# EAGLE design SparkFun_Polar-HeartRate (EAGLE 7.2.0)
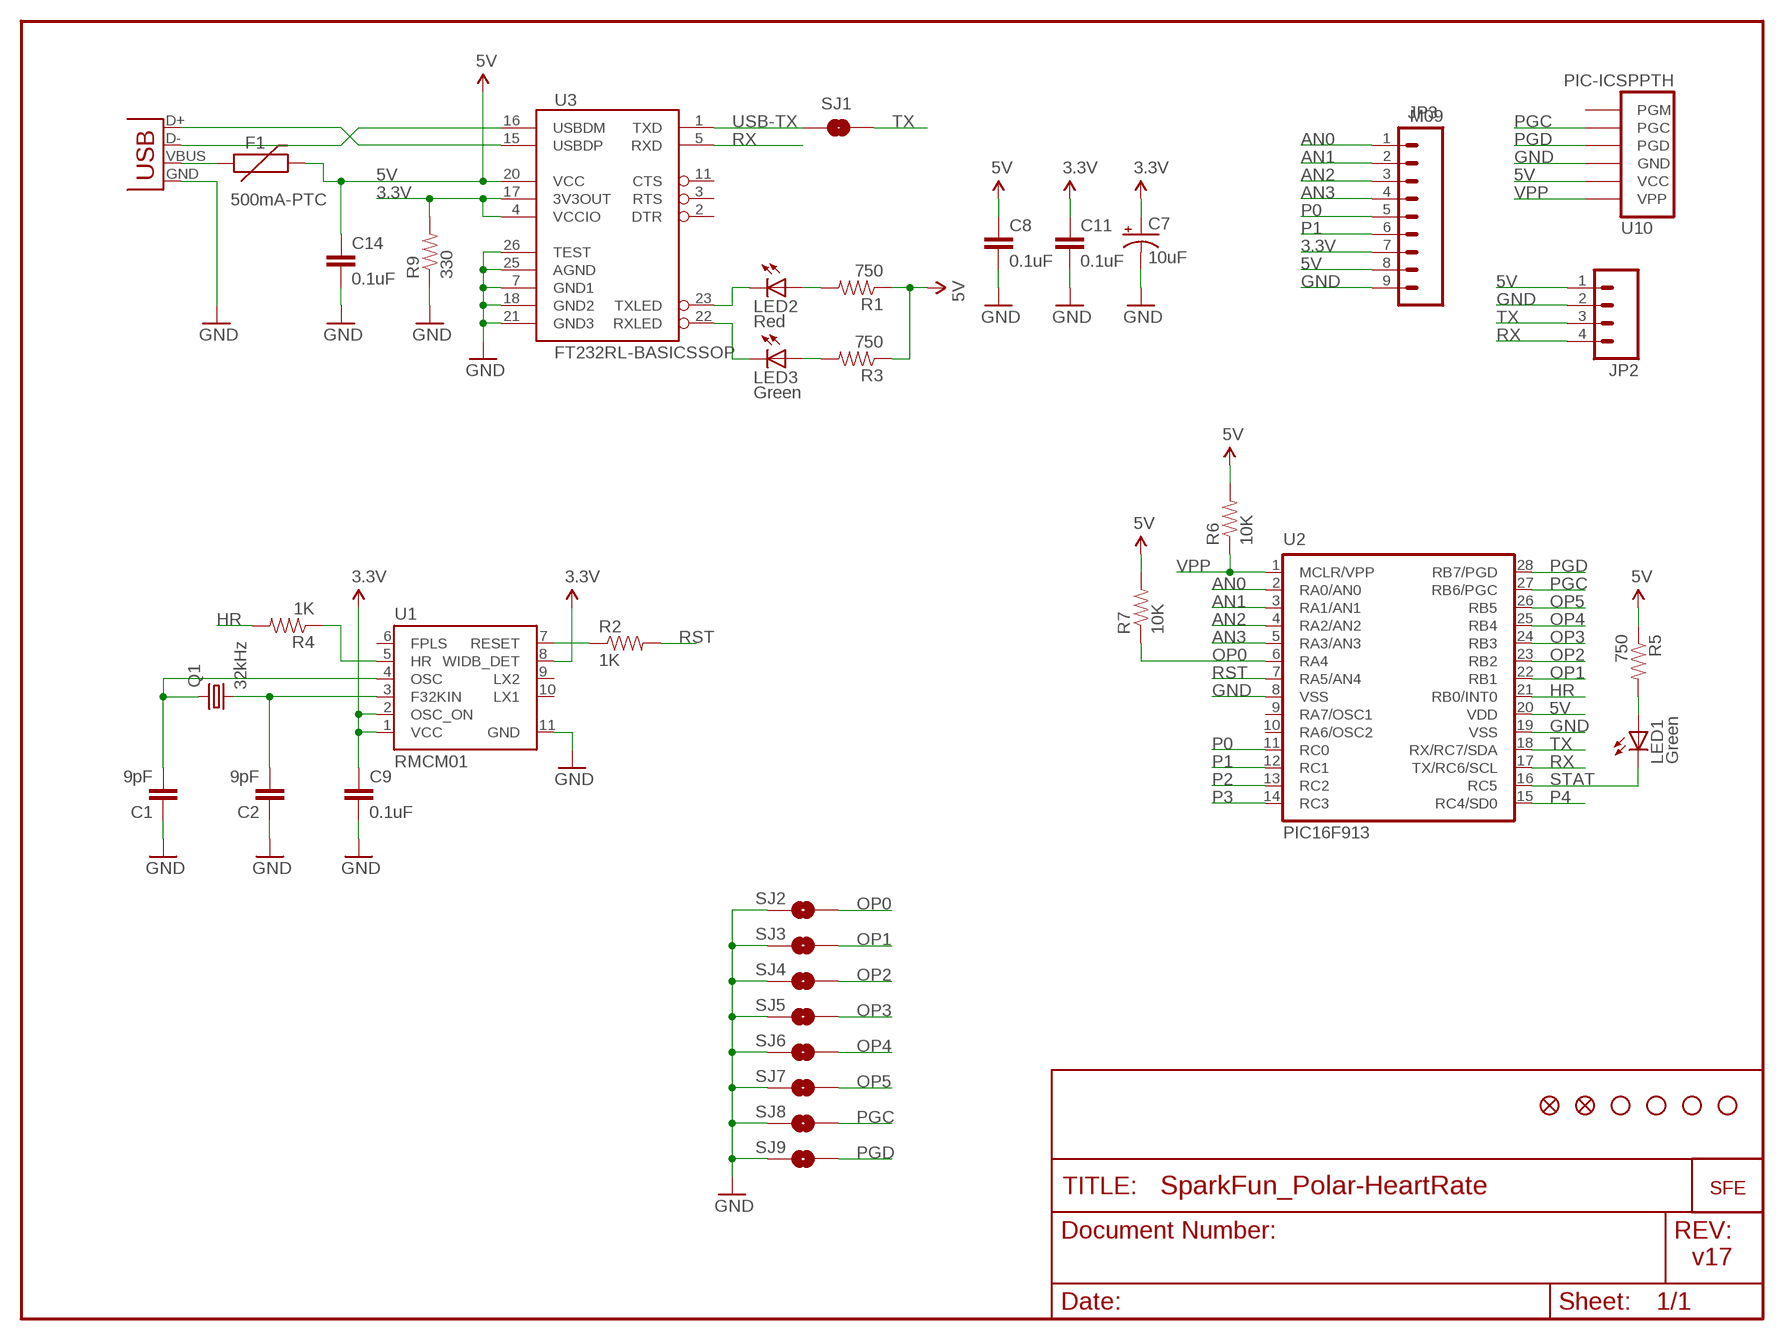
[diagram p0: schematic, sheet 1]

## Parts
C1  9pF  CAP0402-CAP  [0402-CAP]
C2  9pF  CAP0402-CAP  [0402-CAP]
C7  10uF  CAP_POL1206  [EIA3216]
C8  0.1uF  CAP0402-CAP  [0402-CAP]
C9  0.1uF  CAP0402-CAP  [0402-CAP]
C11  0.1uF  CAP0402-CAP  [0402-CAP]
C14  0.1uF  CAP0402-CAP  [0402-CAP]
F1  500mA-PTC  PTCSMD  [PTC-1206]
JP2  M04PTH  [1X04]
JP3  M09  [1X09]
LED1  Green  LED0603  [LED-0603]
LED2  Red  LED0603  [LED-0603]
LED3  Green  LED0603  [LED-0603]
Q1  32kHz  CRYSTALEPSONMC146  [CRYSTAL-32KHZ-SMD_EPSON_MC146]
R1  750  RESISTOR0402-RES  [0402-RES]
R2  1K  RESISTOR0402-RES  [0402-RES]
R3  750  RESISTOR0402-RES  [0402-RES]
R4  1K  RESISTOR0402-RES  [0402-RES]
R5  750  RESISTOR0402-RES  [0402-RES]
R6  10K  RESISTOR0402-RES  [0402-RES]
R7  10K  RESISTOR0402-RES  [0402-RES]
R9  330  RESISTOR0402-RES  [0402-RES]
SJ1  SOLDERJUMPERNC2  [SJ_2S-NOTRACE]
SJ2  SOLDERJUMPERNO  [SJ_2S-NO]
SJ3  SOLDERJUMPERNO  [SJ_2S-NO]
SJ4  SOLDERJUMPERNO  [SJ_2S-NO]
SJ5  SOLDERJUMPERNO  [SJ_2S-NO]
SJ6  SOLDERJUMPERNO  [SJ_2S-NO]
SJ7  SOLDERJUMPERNO  [SJ_2S-NO]
SJ8  SOLDERJUMPERNO  [SJ_2S-NO]
SJ9  SOLDERJUMPERNO  [SJ_2S-NO]
U1  RMCM01  RMCM01SMD  [RMCM01]
U2  PIC16F913  PIC16F913SOIC28  [SO-28W]
U3  FT232RL-BASICSSOP  [SSOP28DB]
U10  PIC-ICSPPTH  [MOLEX-1X6]
U$1  LOGO-SFENEW  [SFE-NEW-WEBLOGO]
U$4  FIDUCIAL1X2  [FIDUCIAL-1X2]
U$8  FIDUCIAL1X2  [FIDUCIAL-1X2]
U$13  STAND-OFF  [STAND-OFF]
U$15  STAND-OFF  [STAND-OFF]
U$16  STAND-OFF  [STAND-OFF]
U$17  STAND-OFF  [STAND-OFF]
X1  USBSMD  [USB-MINIB]

## Nets
3.3V [power]: C7.A(+) C9.1 C11.1 JP3.7 R9.2 U1.1(VCC) U1.2(OSC_ON) U1.8(WIDB_DET) U3.4(VCCIO) U3.17(3V3OUT)
5V: C8.1 C14.1 F1.2 JP2.1 JP3.8 R1.1 R3.1 R5.1 R6.2 R7.2 U2.20(VDD) U3.20(VCC) U10.5(VCC)
AN0: JP3.1 U2.2(RA0/AN0)
AN1: JP3.2 U2.3(RA1/AN1)
AN2: JP3.3 U2.4(RA2/AN2)
AN3: JP3.4 U2.5(RA3/AN3)
GND: C1.1 C2.1 C7.C(-) C8.2 C9.2 C11.2 C14.2 JP2.2 JP3.9 R9.1 SJ2.1 SJ3.1 SJ4.1 SJ5.1 SJ6.1 SJ7.1 SJ8.1 SJ9.1 U1.11(GND) U2.8(VSS) U2.19(VSS) U3.7(GND1) U3.18(GND2) U3.21(GND3) U3.25(AGND) U3.26(TEST) U10.4(GND) X1.GND
HR: R4.2 U2.21(RB0/INT0)
N$1: LED2.A R1.2
N$3: U3.16(USBDM) X1.D-
N$4: LED3.A R3.2
N$5: U3.15(USBDP) X1.D+
N$6: LED1.A R5.2
N$7: R4.1 U1.5(HR)
N$8: R2.1 U1.7(RESET)
N$53: C1.2 Q1.P$1 U1.4(OSC)
N$54: C2.2 Q1.P$2 U1.3(F32KIN)
OP0: R7.1 SJ2.2 U2.6(RA4)
OP1: SJ3.2 U2.22(RB1)
OP2: SJ4.2 U2.23(RB2)
OP3: SJ5.2 U2.24(RB3)
OP4: SJ6.2 U2.25(RB4)
OP5: SJ7.2 U2.26(RB5)
P0: JP3.5 U2.11(RC0)
P1: JP3.6 U2.12(RC1)
P2: U2.13(RC2)
P3: U2.14(RC3)
P4: U2.15(RC4/SD0)
PGC: SJ8.2 U2.27(RB6/PGC) U10.2(PGC)
PGD: SJ9.2 U2.28(RB7/PGD) U10.3(PGD)
RST: R2.2 U2.7(RA5/AN4)
RX: JP2.4 U2.17(TX/RC6/SCL) U3.5(RXD)
RXLED: LED3.C U3.22(RXLED)
STAT: LED1.C U2.16(RC5)
TX: JP2.3 SJ1.2 U2.18(RX/RC7/SDA)
TXLED: LED2.C U3.23(TXLED)
USB-TX: SJ1.1 U3.1(TXD)
VBUS [power]: F1.1 X1.VBUS
VPP: R6.1 U2.1(MCLR/VPP) U10.6(VPP)
Unconnected: U1.6(FPLS) U1.9(LX2) U1.10(LX1) U2.9(RA7/OSC1) U2.10(RA6/OSC2) U3.2(DTR) U3.3(RTS) U3.11(CTS) U10.1(PGM)

## Notes on the sheet
- v17

## Library data of the parts
C1 C2 C8 C9 C11 C14 = SparkFun:CAP: Capacitor Standard 0603 ceramic capacitor, and 0.1" leaded capacitor.
C7 = SparkFun:CAP_POL: Capacitor Polarized These are standard SMD and PTH capacitors. Normally 10uF, 47uF, and 100uF in electrolytic and tantalum varieties. Always verify the external diameter of the through hole cap, it varies with capacity, voltage, and manufacturer. The EIA devices should be standard.
F1 = SparkFun:PTC: Resettable Fuse PTC Resettable Fuse. Spark Fun Electronics SKU : COM-08357
JP2 = SparkFun:M04: Header 4 Standard 4-pin 0.1" header. Use with straight break away headers (SKU : PRT-00116), right angle break away headers (PRT-00553), swiss pins (PRT-00743), machine pins (PRT-00117), and female headers (PRT-00115). Molex polarized connector foot print use with SKU : PRT-08231 with associated crimp pins and housings.
JP3 = SparkFun:M09: Header 9 Standard 9-pin 0.1" header. Use with straight break away headers (SKU : PRT-00116), right angle break away headers (PRT-00553), swiss pins (PRT-00743), machine pins (PRT-00117), and female headers (PRT-00115).
LED1-LED3 = SparkFun:LED: LEDs Standard schematic elements and footprints for 5mm, 3mm, 1206, and 0603 sized LEDs. 5mm - Spark Fun Electronics SKU : COM-00529 (and others)
Q1 = SparkFun:CRYSTAL: Crystals Various standard crystals. Proven footprints. Spark Fun Electronics SKU : COM-00534
R1-R7 R9 = SparkFun:RESISTOR: Resistor Basic schematic elements and footprints for 0603, 1206, and PTH 1/10th watt (small) resistors.
SJ1-SJ9 = SparkFun:SOLDERJUMPER: Solder Jumper Standard SMD solder jumper. Used to automate production. Two varients : Normally Open and Normally Closed are the same, but have different paste layers. NC will have a large amount of paste and should jumper during reflow.
U1 = SparkFun:RMCM01
U2 = SparkFun:PIC16F913
U3 = SparkFun:FT232RL-BASIC: USB UART This is the simplified version of the FT232RL unit. Only what you need, nothing you don't. Spark Fun Electronics SKU : COM-00650
U10 = SparkFun:PIC-ICSP: ISCP Programming connector for UAV, UBW Kit, etc.
U$1 = SparkFun:LOGO-SFE: Spark Fun Electronics PCB Logo This is the standard Spark Fun Electronics PCB logo.
U$4 U$8 = SparkFun:FIDUCIAL: Fiducial Alignment Points Various fiducial points for machine vision alignment.
U$13 U$15-U$17 = SparkFun:STAND-OFF: Stand Off This is the mechanical footprint for a #4 phillips button head screw. Use the keepout ring to avoid running the screw head into surrounding components. SKU : PRT-00447
X1 = SparkFun:USB: USB Connectors USB-B-PTH is fully proven SKU : PRT-00139 USB-miniB is fully proven SKU : PRT-00587 USB-A-PCB is untested. USB-A-H is throughly reviewed, but untested. Spark Fun Electronics SKU : PRT-00437 USB-B-SMT is throughly reviewed, but untested. Needs silkscreen touching up. USB-A-S has not been used/tested USB-MB-H has not been used/tested

## Net classes
0 default: width 0.178 mm
1 power: width 0.178 mm

## Board
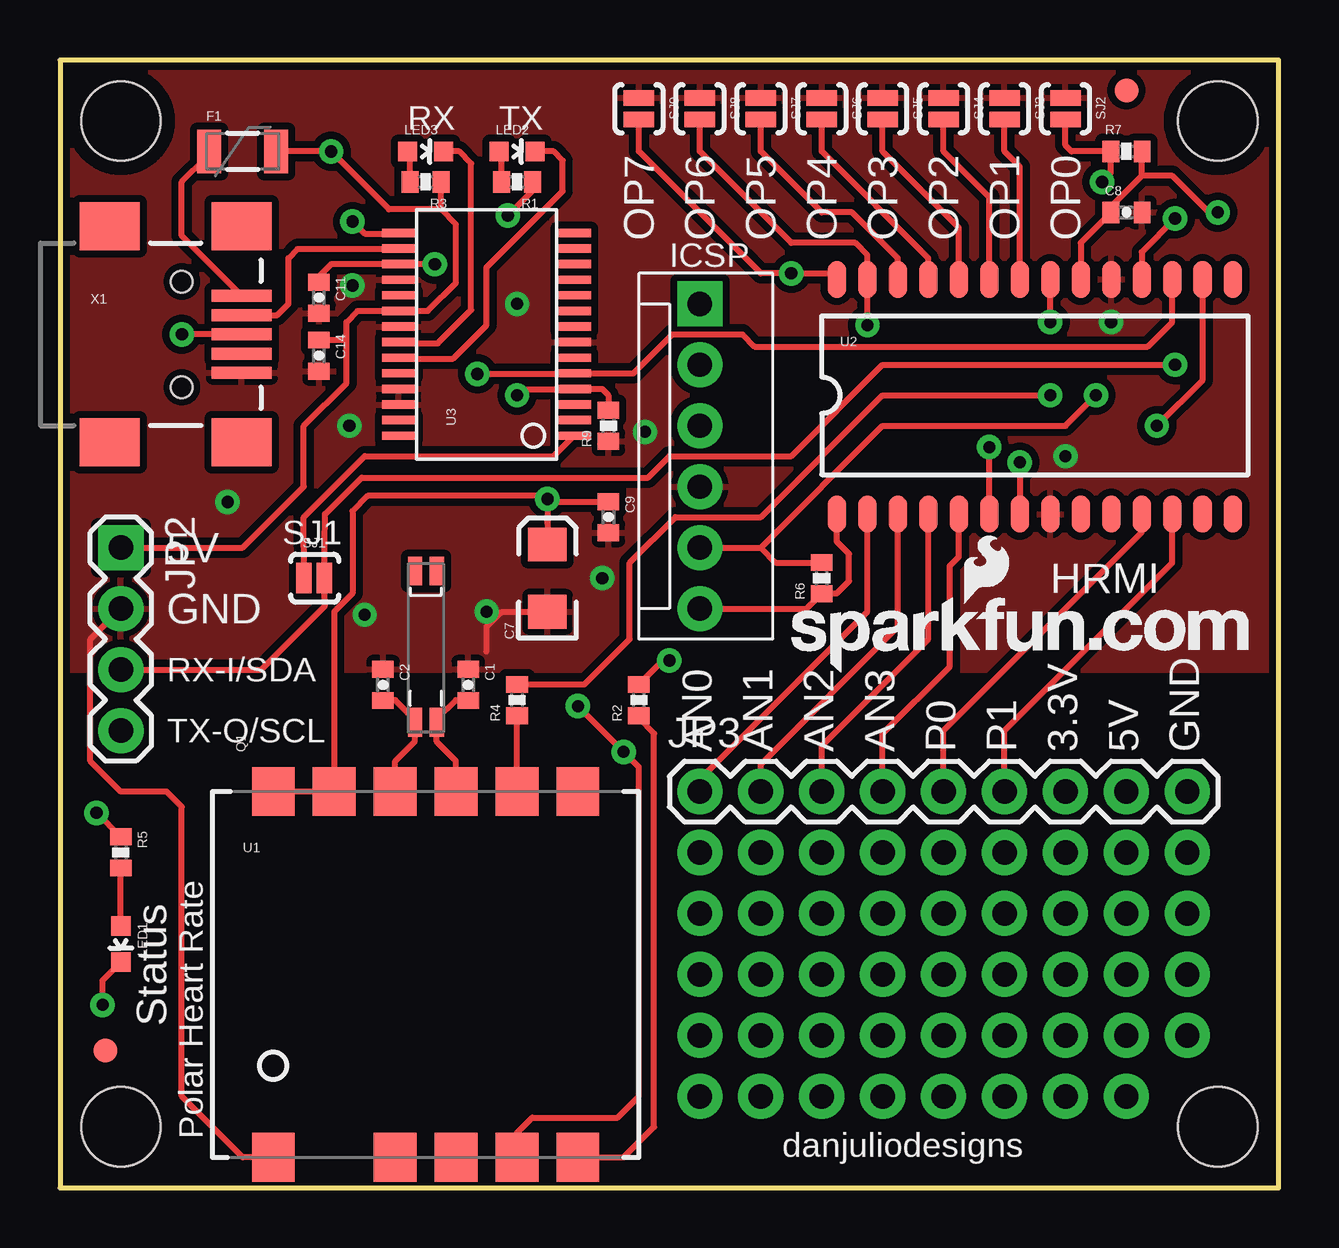
[diagram p1: board, top side]
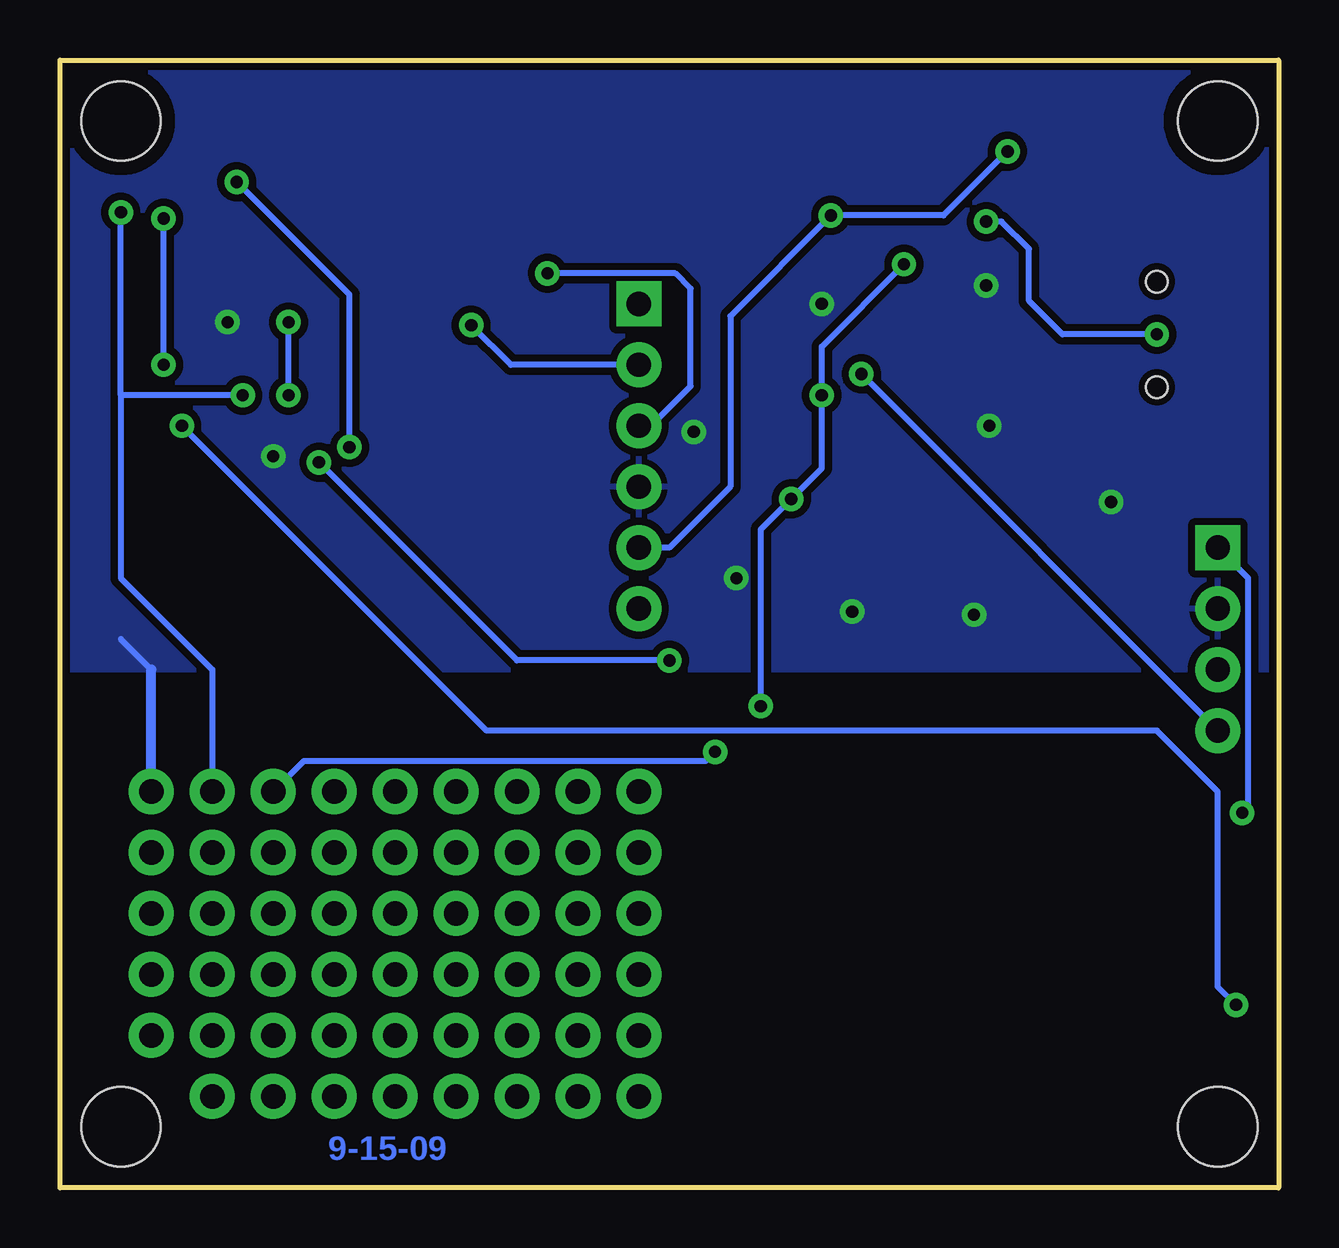
[diagram p2: board, bottom side, seen from below]

Size 50.8 x 46.99 mm. Coordinates in mm from the lower left corner, seen from the top.
Outline: 0,0 50.8,0 50.8,46.99 0,46.99 0,0
Copper layers (1*16): Top 0.035mm / dielectric 1.5mm / Bottom 0.035mm
Design rules "SparkFun": minimum track width 8mil, minimum drill 20mil, track to track 8mil, track to pad 8mil, pad to pad 8mil, via to via 8mil, smd to smd 8mil, copper to edge 10mil, drill to drill 8mil, minimum pad ring 12mil, minimum via ring 10mil, stop-mask expansion 4mil, vias tented up to drill 25mil, thermal gap 10mil

### Footprints (pad centres in the part's own frame; a part is rotated, then mirrored left to right if it is on the bottom)
0402-CAP = smd 0.7 x 0.9: 1 -0.65,0; 2 0.65,0
EIA3216 = smd 1.4 x 1.6: A 1.4,0; C -1.4,0
PTC-1206 = smd 1 x 1.8: 1 -1.4,0; 2 1.4,0
1X04 = drill 1.016 pad 1.88 square: 1 0,0 | drill 1.016 pad 1.88: 2 2.54,0; 3 5.08,0; 4 7.62,0
1X09 = drill 1.016 pad 1.88: 1 0,0; 2 2.54,0; 3 5.08,0; 4 7.62,0; 5 10.16,0; 6 12.7,0; 7 15.24,0; 8 17.78,0; 9 20.32,0
LED-0603 = smd 0.8 x 0.8: A 0,-0.75; C 0,0.75
CRYSTAL-32KHZ-SMD_EPSON_MC146 = smd 1.2 x 0.6: NC1 6.9,1.2; NC2 6.9,0.3; P$1 0.6,0.3; P$2 0.6,1.2
0402-RES = smd 0.7 x 0.9: 1 -0.65,0; 2 0.65,0
SJ_2S-NOTRACE = smd 0.635 x 1.27: 1 -0.45,0; 2 0.4,0
SJ_2S-NO = smd 0.635 x 1.27: 1 -0.45,0; 2 0.45,0
RMCM01 = smd 1.778 x 2.032: 1 -6.35,7.62; 2 -3.81,7.62; 3 -1.27,7.62; 4 1.27,7.62; 5 3.81,7.62; 6 6.35,7.62; 7 6.35,-7.62; 8 3.81,-7.62; 9 1.27,-7.62; 10 -1.27,-7.62; 11 -6.35,-7.62
SO-28W = smd 0.762 x 1.524: 1 -8.255,-4.953; 2 -6.985,-4.953; 3 -5.715,-4.953; 4 -4.445,-4.953; 5 -3.175,-4.953; 6 -1.905,-4.953; 7 -0.635,-4.953; 8 0.635,-4.953; 9 1.905,-4.953; 10 3.175,-4.953; 11 4.445,-4.953; 12 5.715,-4.953; 13 6.985,-4.953; 14 8.255,-4.953; 15 8.255,4.826; 16 6.985,4.826; 17 5.715,4.826; 18 4.445,4.826; 19 3.175,4.826; 20 1.905,4.826; 21 0.635,4.826; 22 -0.635,4.826; 23 -1.905,4.826; 24 -3.175,4.826; 25 -4.445,4.826; 26 -5.715,4.826; 27 -6.985,4.826; 28 -8.255,4.826
SSOP28DB = smd 0.348 x 1.397: 1 -4.225,-3.656; 2 -3.575,-3.656; 3 -2.925,-3.656; 4 -2.275,-3.656; 5 -1.625,-3.656; 6 -0.975,-3.656; 7 -0.325,-3.656; 8 0.325,-3.656; 9 0.975,-3.656; 10 1.625,-3.656; 11 2.275,-3.656; 12 2.925,-3.656; 13 3.575,-3.656; 14 4.225,-3.656; 15 4.225,3.656; 16 3.575,3.656; 17 2.925,3.656; 18 2.275,3.656; 19 1.625,3.656; 20 0.975,3.656; 21 0.325,3.656; 22 -0.325,3.656; 23 -0.975,3.656; 24 -1.625,3.656; 25 -2.275,3.656; 26 -2.925,3.656; 27 -3.575,3.656; 28 -4.225,3.656
MOLEX-1X6 = drill 1.016 pad 1.88 square: 1 0,0 | drill 1.016 pad 1.88: 2 2.54,0; 3 5.08,0; 4 7.62,0; 5 10.16,0; 6 12.7,0
FIDUCIAL-1X2 = smd 1 x 1: 1 0,0
STAND-OFF = hole 3.302: 0,0
USB-MINIB = smd 2.5 x 0.5: D+ 2.5,0; D- 2.5,0.8; GND 2.5,-1.6; ID 2.5,-0.8; VBUS 2.5,1.6 | smd 2.5 x 2: GND@1 -3,-4.5; GND@2 -3,4.5; GND@3 2.5,4.5; GND@4 2.5,-4.5 | hole 0.9: 0,2.2; 0,-2.2

### Placement (x,y rotation side)
C1  17.02,20.95 270 top
C2  13.46,20.95 270 top
C7  20.32,25.4 90 top
C8  44.45,40.64 0 top
C9  22.86,27.94 270 top
C11  10.79,37.08 270 top
C14  10.79,34.67 270 top
F1  7.62,43.18 0 top
JP2  2.54,26.67 270 top
JP3  26.67,16.51 0 top
LED1  2.54,10.16 180 top
LED2  19.05,43.18 270 top
LED3  15.24,43.18 270 top
Q1  16,18.8 90 top
R1  19.05,41.91 180 top
R2  24.13,20.32 90 top
R3  15.24,41.91 180 top
R4  19.05,20.32 90 top
R5  2.54,13.97 270 top
R6  31.75,25.4 90 top
R7  44.45,43.18 0 top
R9  22.86,31.75 90 top
SJ1  10.62,25.4 0 top
SJ2  41.91,44.96 270 top
SJ3  39.37,44.96 270 top
SJ4  36.83,44.96 270 top
SJ5  34.29,44.96 270 top
SJ6  31.75,44.96 270 top
SJ7  29.21,44.96 270 top
SJ8  26.67,44.96 270 top
SJ9  24.13,44.96 270 top
U1  15.24,8.89 0 top
U2  40.64,33.02 0 top
U3  17.78,35.56 90 top
U10  26.67,36.83 270 top
U$1  30.48,21.46 0 top
U$4  1.91,5.71 0 top
U$8  44.45,45.72 0 top
U$13  2.54,2.54 0 top
U$15  48.26,2.54 0 top
U$16  2.54,44.45 0 top
U$17  48.26,44.45 270 top
X1  5.08,35.56 0 top

### Tracks (layer width: path | path; a pad name or v marks a point on that pad's centre or on a via)
3.3V  (via drill 0.51)
  Top 0.254: U3.17 | U1.1 U1.2 11.43,24 12.19,24.77 12.19,28.19 12.83,28.83 20.19,28.83 v20.32,28.7 | C7.A 20.45,26.67 | 21.45,33.28 21.46,33.27 | 21.45,33.28 U3.4 21.43,33.27 19.3,33.27 v19.05,33.02 | v15.62,38.48 U3.17 | C7.A 20.32,26.67 | 20.32,27.69 20.32,27.94 | 20.32,27.69 C7.A | C11.1 10.79,37.97 11.3,38.48 U3.17 | v20.32,28.7 20.32,27.69 | U1.8 19.05,2.29 19.68,2.92 23.24,2.92 24.13,3.81 24.13,17.53 v23.5,18.16 v21.59,20.07 | 21.45,33.28 22.59,33.28 22.86,33.02 R9.2 22.86,32.38 | C9.1 20.43,28.59 v20.32,28.7
  Bottom 0.254: v15.62,38.48 19.05,35.05 v19.05,33.02 19.05,29.97 v20.32,28.7 21.59,27.43 v21.59,20.07 | JP3.7 40.64,17.78 23.88,17.78 v23.5,18.16
5V  (via drill 0.51)
  Top 0.254: F1.2 v11.3,43.18 13.72,40.77 15.88,40.77 | R3.1 15.89,40.78 15.88,40.77 | 15.88,40.77 16.51,40.13 16.51,37.72 15.33,36.53 U3.20 12.4,36.53 11.94,36.07 11.94,35.31 | R1.1 19.7,41.54 v18.67,40.51 | 45.09,43.18 R7.2 45.1,43.07 45.09,43.05 45.09,42.16 | 45.09,42.16 43.8,40.88 C8.1 43.81,40.64 42.55,39.37 U2.20 | JP2.1 7.62,26.67 10.16,29.21 10.16,31.75 11.94,33.53 11.94,35.31 | R5.1 2.54,14.61 v1.52,15.62 | v48.26,40.64 47.88,40.64 46.35,42.16 45.09,42.16 | 29.21,26.67 34.29,31.75 41.91,31.75 v43.18,33.02 | R6.2 29.83,26.05 29.21,26.67 | C14.1 11.92,35.32 11.94,35.31 | U10.5 29.21,26.67
  Bottom 0.254: v11.3,43.18 13.97,40.51 v18.67,40.51 22.86,36.32 22.86,29.21 25.4,26.67 U10.5 | JP2.1 1.27,25.4 1.27,15.88 v1.52,15.62 | JP3.8 44.45,21.59 48.26,25.4 48.26,33.02 | 48.26,33.02 v48.26,40.64 | v43.18,33.02 48.26,33.02
AN0
  Top 0.254: JP3.1 26.67,17.02 33.66,24 U2.2
AN1
  Top 0.254: U2.3 34.92,23.37 29.21,17.65 JP3.2
AN2
  Top 0.254: U2.4 36.2,22.86 31.75,18.41 JP3.3
AN3
  Top 0.254: JP3.4 34.29,18.92 37.08,21.72 37.08,25.91 37.47,26.29 U2.5
GND  (via drill 0.51)
  Top 0.254: U1.11 7.62,1.27 5.08,3.81 5.08,15.88 4.45,16.51 2.54,16.51 1.27,17.78 1.27,22.86 JP2.2 | C7.C 18.41,24 17.78,23.37 17.78,22.35
  Bottom 0.254: 46.99,21.59 48.26,22.86
  Bottom 0.406: JP3.9 46.99,21.59
  other vias: 12.06,31.75 19.05,36.83 43.81,36.07 22.61,25.4 41.91,30.48 6.99,28.57 12.19,37.59 24.38,31.5 17.78,24 12.7,23.88
  pour Bottom (isolate 0.305): 0,21.59 11.43,21.59 19.05,21.59 50.8,21.59 50.8,46.99 0,46.99
  pour Top (isolate 0.305): 0,21.59 11.43,21.59 19.05,21.59 50.8,21.59 50.8,46.99 0,46.99
HR  (via drill 0.51)
  Top 0.254: v41.27,36.07 U2.21 | 19.05,20.95 R4.2 21.86,20.97 23.75,22.86 23.75,26.04 25.65,27.94 29.21,27.94 34.29,33.02 v41.27,33.02
  Bottom 0.254: v41.27,33.02 v41.27,36.07
N$1
  Top 0.254: LED2.A 18.29,43.18 arc-90 18.4,43.07 R1.2
N$2  (via drill 1.02 pad 1.88)
  other vias: 26.67,13.97
N$3
  Top 0.254: 7.62,36.32 X1.D- 9.05,36.36 9.53,36.83 9.53,38.73 9.91,39.12 14.11,39.12 U3.16
N$4
  Top 0.254: LED3.A 14.48,43.18 arc-90 14.59,43.07 R3.2
N$5  (via drill 0.51)
  Top 0.254: X1.D+ v5.08,35.56 | U3.15 14.1,39.76 14.1,39.75 12.7,39.75 v12.19,40.26
  Bottom 0.254: v5.08,35.56 9.02,35.56 10.41,36.96 10.41,39.12 11.56,40.26 v12.19,40.26
N$6
  Top 0.254: LED1.A R5.2
N$7
  Top 0.254: U1.5 R4.1
N$8
  Top 0.254: 24.13,19.68 R2.1 24.13,19.56 24.77,18.92 24.77,2.54 23.5,1.27 U1.7
N$10  (via drill 1.02 pad 1.88)
  other vias: 29.21,13.97
N$11  (via drill 1.02 pad 1.88)
  other vias: 31.75,13.97
N$12  (via drill 1.02 pad 1.88)
  other vias: 34.29,13.97
N$13  (via drill 1.02 pad 1.88)
  other vias: 36.83,13.97
N$14  (via drill 1.02 pad 1.88)
  other vias: 39.37,13.97
N$15  (via drill 1.02 pad 1.88)
  other vias: 41.91,13.97
N$16  (via drill 1.02 pad 1.88)
  other vias: 44.45,13.97
N$17  (via drill 1.02 pad 1.88)
  other vias: 46.99,13.97
N$18  (via drill 1.02 pad 1.88)
  other vias: 46.99,11.43
N$19  (via drill 1.02 pad 1.88)
  other vias: 44.45,11.43
N$20  (via drill 1.02 pad 1.88)
  other vias: 41.91,11.43
N$21  (via drill 1.02 pad 1.88)
  other vias: 39.37,11.43
N$22  (via drill 1.02 pad 1.88)
  other vias: 36.83,11.43
N$23  (via drill 1.02 pad 1.88)
  other vias: 34.29,11.43
N$24  (via drill 1.02 pad 1.88)
  other vias: 31.75,11.43
N$25  (via drill 1.02 pad 1.88)
  other vias: 29.21,11.43
N$26  (via drill 1.02 pad 1.88)
  other vias: 26.67,11.43
N$27  (via drill 1.02 pad 1.88)
  other vias: 26.67,8.89
N$28  (via drill 1.02 pad 1.88)
  other vias: 29.21,8.89
N$29  (via drill 1.02 pad 1.88)
  other vias: 31.75,8.89
N$30  (via drill 1.02 pad 1.88)
  other vias: 34.29,8.89
N$31  (via drill 1.02 pad 1.88)
  other vias: 36.83,8.89
N$32  (via drill 1.02 pad 1.88)
  other vias: 39.37,8.89
N$33  (via drill 1.02 pad 1.88)
  other vias: 41.91,8.89
N$34  (via drill 1.02 pad 1.88)
  other vias: 44.45,8.89
N$35  (via drill 1.02 pad 1.88)
  other vias: 46.99,8.89
N$36  (via drill 1.02 pad 1.88)
  other vias: 46.99,6.35
N$37  (via drill 1.02 pad 1.88)
  other vias: 44.45,6.35
N$38  (via drill 1.02 pad 1.88)
  other vias: 41.91,6.35
N$39  (via drill 1.02 pad 1.88)
  other vias: 39.37,6.35
N$40  (via drill 1.02 pad 1.88)
  other vias: 36.83,6.35
N$41  (via drill 1.02 pad 1.88)
  other vias: 34.29,6.35
N$42  (via drill 1.02 pad 1.88)
  other vias: 31.75,6.35
N$43  (via drill 1.02 pad 1.88)
  other vias: 29.21,6.35
N$44  (via drill 1.02 pad 1.88)
  other vias: 26.67,6.35
N$45  (via drill 1.02 pad 1.88)
  other vias: 26.67,3.81
N$46  (via drill 1.02 pad 1.88)
  other vias: 29.21,3.81
N$47  (via drill 1.02 pad 1.88)
  other vias: 31.75,3.81
N$48  (via drill 1.02 pad 1.88)
  other vias: 34.29,3.81
N$49  (via drill 1.02 pad 1.88)
  other vias: 36.83,3.81
N$50  (via drill 1.02 pad 1.88)
  other vias: 39.37,3.81
N$51  (via drill 1.02 pad 1.88)
  other vias: 41.91,3.81
N$52  (via drill 1.02 pad 1.88)
  other vias: 44.45,3.81
N$53
  Top 0.254: U1.4 16.51,17.78 15.7,18.59 Q1.P$1 15.7,19.51 16.51,20.32 17,20.32 C1.2
N$54
  Top 0.254: U1.3 13.97,17.78 14.8,18.61 Q1.P$2 14.8,19.49 13.97,20.32 13.48,20.32 C2.2
OP0  (via drill 0.51)
  Top 0.254: U2.6 v38.73,30.86 | v43.43,41.91 43.8,42.28 R7.1 42.16,43.18 41.91,43.43 SJ2.2
  Bottom 0.254: v38.73,30.86 38.73,37.21 v43.43,41.91
OP1
  Top 0.254: U2.22 40.01,42.55 39.37,43.18 SJ3.2
OP2
  Top 0.254: U2.23 38.73,41.27 36.83,43.18 SJ4.2
OP3
  Top 0.254: U2.24 37.47,40.01 34.29,43.18 SJ5.2
OP4
  Top 0.254: 36.2,37.59 U2.25 36.2,38.73 31.75,43.18 SJ6.2
OP5
  Top 0.254: U2.26 34.92,38.73 33.02,40.64 31.75,40.64 29.21,43.18 SJ7.2
P0
  Top 0.254: U2.11 45.09,27.3 36.83,19.05 JP3.5
P1
  Top 0.254: U2.12 46.35,26.04 39.37,19.05 JP3.6
PGC  (via drill 0.51)
  Top 0.254: v33.66,35.94 U2.27 33.66,38.86 33.15,39.37 30.48,39.37 26.67,43.18 SJ8.2
  Bottom 0.254: v33.66,35.94 32,34.29 U10.2
PGD  (via drill 0.51)
  Top 0.254: SJ9.2 24.13,43.18 29.21,38.1 v30.48,38.1 32.13,38.1 U2.28
  Bottom 0.254: v30.48,38.1 25.15,38.1 24.51,37.47 24.51,33.4 26.16,31.75 U10.3
RST  (via drill 0.51)
  Top 0.254: v40.01,30.23 U2.7 | R2.2 25.13,21.97 v25.4,21.97
  Bottom 0.254: v25.4,21.97 31.75,21.97 v40.01,30.23
RX  (via drill 0.51)
  Top 0.254: U2.17 46.35,36.07 45.34,35.05 28.96,35.05 28.45,35.56 25.53,35.56 25.02,35.05 23.9,33.94 21.23,33.94 | 21.23,33.94 21.21,33.91 | 21.23,33.94 U3.5 21.46,33.91 v17.4,33.91
  Bottom 0.254: JP2.4 v17.4,33.91
RXLED
  Top 0.254: LED3.C 16.64,43.18 17.14,42.67 17.14,36.58 15.75,35.18 14.1,35.18 14.12,35.21 U3.22
STAT  (via drill 0.51)
  Top 0.254: U2.16 47.62,33.66 v45.72,31.75 | LED1.C 2.54,9.4 1.78,8.64 v1.78,7.62
  Bottom 0.254: v45.72,31.75 33.02,19.05 5.08,19.05 2.54,16.51 2.54,8.38 v1.78,7.62
TX  (via drill 0.51)
  Top 0.254: JP2.3 8.38,21.59 11.05,24.26 SJ1.2 11.05,28.07 12.57,29.59 24.51,29.59 25.4,30.48 30.48,30.48 34.29,34.29 v46.48,34.29 46.61,34.29 | v46.48,40.39 45.09,38.99 U2.18
  Bottom 0.254: v46.48,34.29 v46.48,40.39
TXLED
  Top 0.254: LED2.C 20.57,43.18 20.95,42.8 20.95,41.53 17.78,38.35 17.78,35.94 16.38,34.54 14.1,34.54 14.12,34.57 U3.23
USB-TX
  Top 0.254: SJ1.1 10.16,27.94 12.7,30.48 20.57,30.48 21.43,31.34 U3.1
VBUS
  Top 0.254: X1.VBUS 5.08,39.66 5.08,41.91 6.1,42.93 6.1,43.18 F1.1
VPP
  Top 0.254: 31.75,24.77 31.11,24.13 U10.6 | U2.1 32.38,26.92 32.89,26.42 32.89,25.27 32.38,24.77 31.75,24.77 | 31.75,24.77 R6.1

### Text on the board
Bottom: 9-15-09
tPlace: RX | TX | OP7 | OP6 | OP5 | OP4 | OP3 | OP2 | OP1 | OP0 | ICSP | SJ1 | 5V | HRMI | GND | RX-I/SDA | TX-O/SCL | AN0 | AN1 | AN2 | AN3 | P0 | P1 | 3.3V | 5V | GND | Status | Polar Heart Rate | danjuliodesigns
tValues: DNP | DNP | DNP | Polar Heart Rate v1.3
Measures: 100.00 | 1050.00 | 1850.00 | 1450.00 | 1350.00 | 1250.00 | 1150.00 | 1050.00 | 950.00 | 850.00 | 750.00 | 650.00 | 0.00 | 0.00 | All Dimensions in mil | Spark Fun Electronics | 1150.00 | 1250.00 | 1350.00 | 1450.00 | 1550.00 | 1650.00 | 1750.00 | 1850.00 | 2000.00